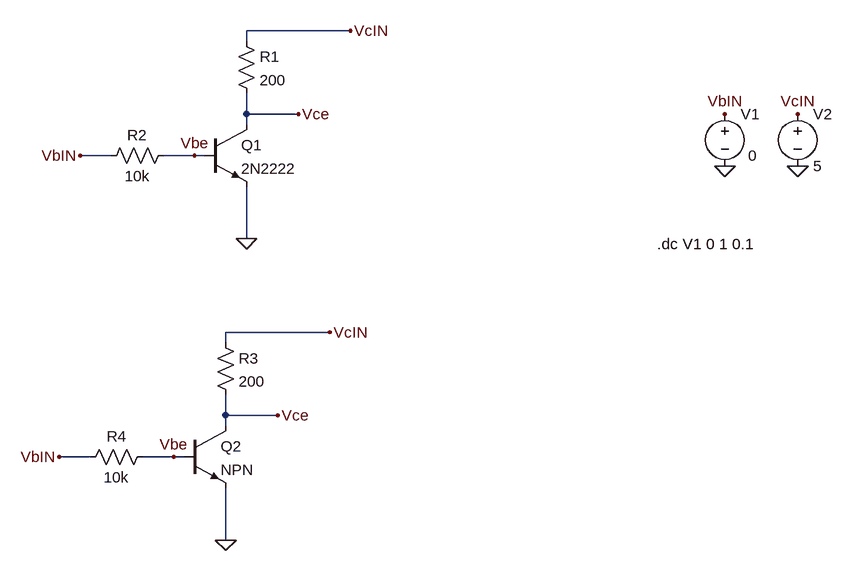
[diagram p0: schematic Experiment1_NPN.asc]
Experiment1_NPN.asc, the LTspice schematic file:
Version 4.1
SHEET 1 1112 756
WIRE 368 -48 208 -48
WIRE 208 -32 208 -48
WIRE 208 80 208 48
WIRE 288 80 208 80
WIRE 208 96 208 80
WIRE 0 144 -48 144
WIRE 128 144 80 144
WIRE 144 144 128 144
WIRE 208 272 208 192
WIRE 336 416 176 416
WIRE 176 432 176 416
WIRE 176 544 176 512
WIRE 256 544 176 544
WIRE 176 560 176 544
WIRE -32 608 -80 608
WIRE 96 608 48 608
WIRE 112 608 96 608
WIRE 176 736 176 656
FLAG 208 272 0
FLAG 368 -48 VcIN
FLAG -48 144 VbIN
FLAG 128 144 Vbe
FLAG 288 80 Vce
FLAG 944 80 VbIN
FLAG 1056 80 VcIN
FLAG 944 160 0
FLAG 1056 160 0
FLAG 176 736 0
FLAG 336 416 VcIN
FLAG -80 608 VbIN
FLAG 96 608 Vbe
FLAG 256 544 Vce
SYMBOL npn 144 96 R0
SYMATTR InstName Q1
SYMATTR Value 2N2222
SYMBOL res 192 -48 R0
SYMATTR InstName R1
SYMATTR Value 200
SYMBOL res 96 128 R90
WINDOW 0 0 56 VBottom 2
WINDOW 3 32 56 VTop 2
SYMATTR InstName R2
SYMATTR Value 10k
SYMBOL voltage 944 64 R0
WINDOW 3 36 80 Left 2
WINDOW 123 0 0 Left 0
WINDOW 39 0 0 Left 0
SYMATTR Value 0
SYMATTR InstName V1
SYMBOL voltage 1056 64 R0
WINDOW 123 0 0 Left 0
WINDOW 39 0 0 Left 0
SYMATTR InstName V2
SYMATTR Value 5
SYMBOL res 160 416 R0
SYMATTR InstName R3
SYMATTR Value 200
SYMBOL res 64 592 R90
WINDOW 0 0 56 VBottom 2
WINDOW 3 32 56 VTop 2
SYMATTR InstName R4
SYMATTR Value 10k
SYMBOL npn2 112 560 R0
SYMATTR InstName Q2
TEXT 840 280 Left 2 !.dc V1 0 1 0.1

The netlist it stands for:
* Experiment1_NPN.asc
Q1 Vce Vbe 0 0 2N2222
R1 VcIN Vce 200
R2 Vbe VbIN 10k
V1 VbIN 0 0
V2 VcIN 0 5
R3 VcIN Vce 200
R4 Vbe VbIN 10k
Q2 Vce Vbe 0 0 NPN
.model NPN NPN
.model PNP PNP
.lib standard.bjt
.dc V1 0 1 0.1
.backanno
.end